# EAGLE schematic mother_card_rs_247pm (EAGLE 8.3.2)
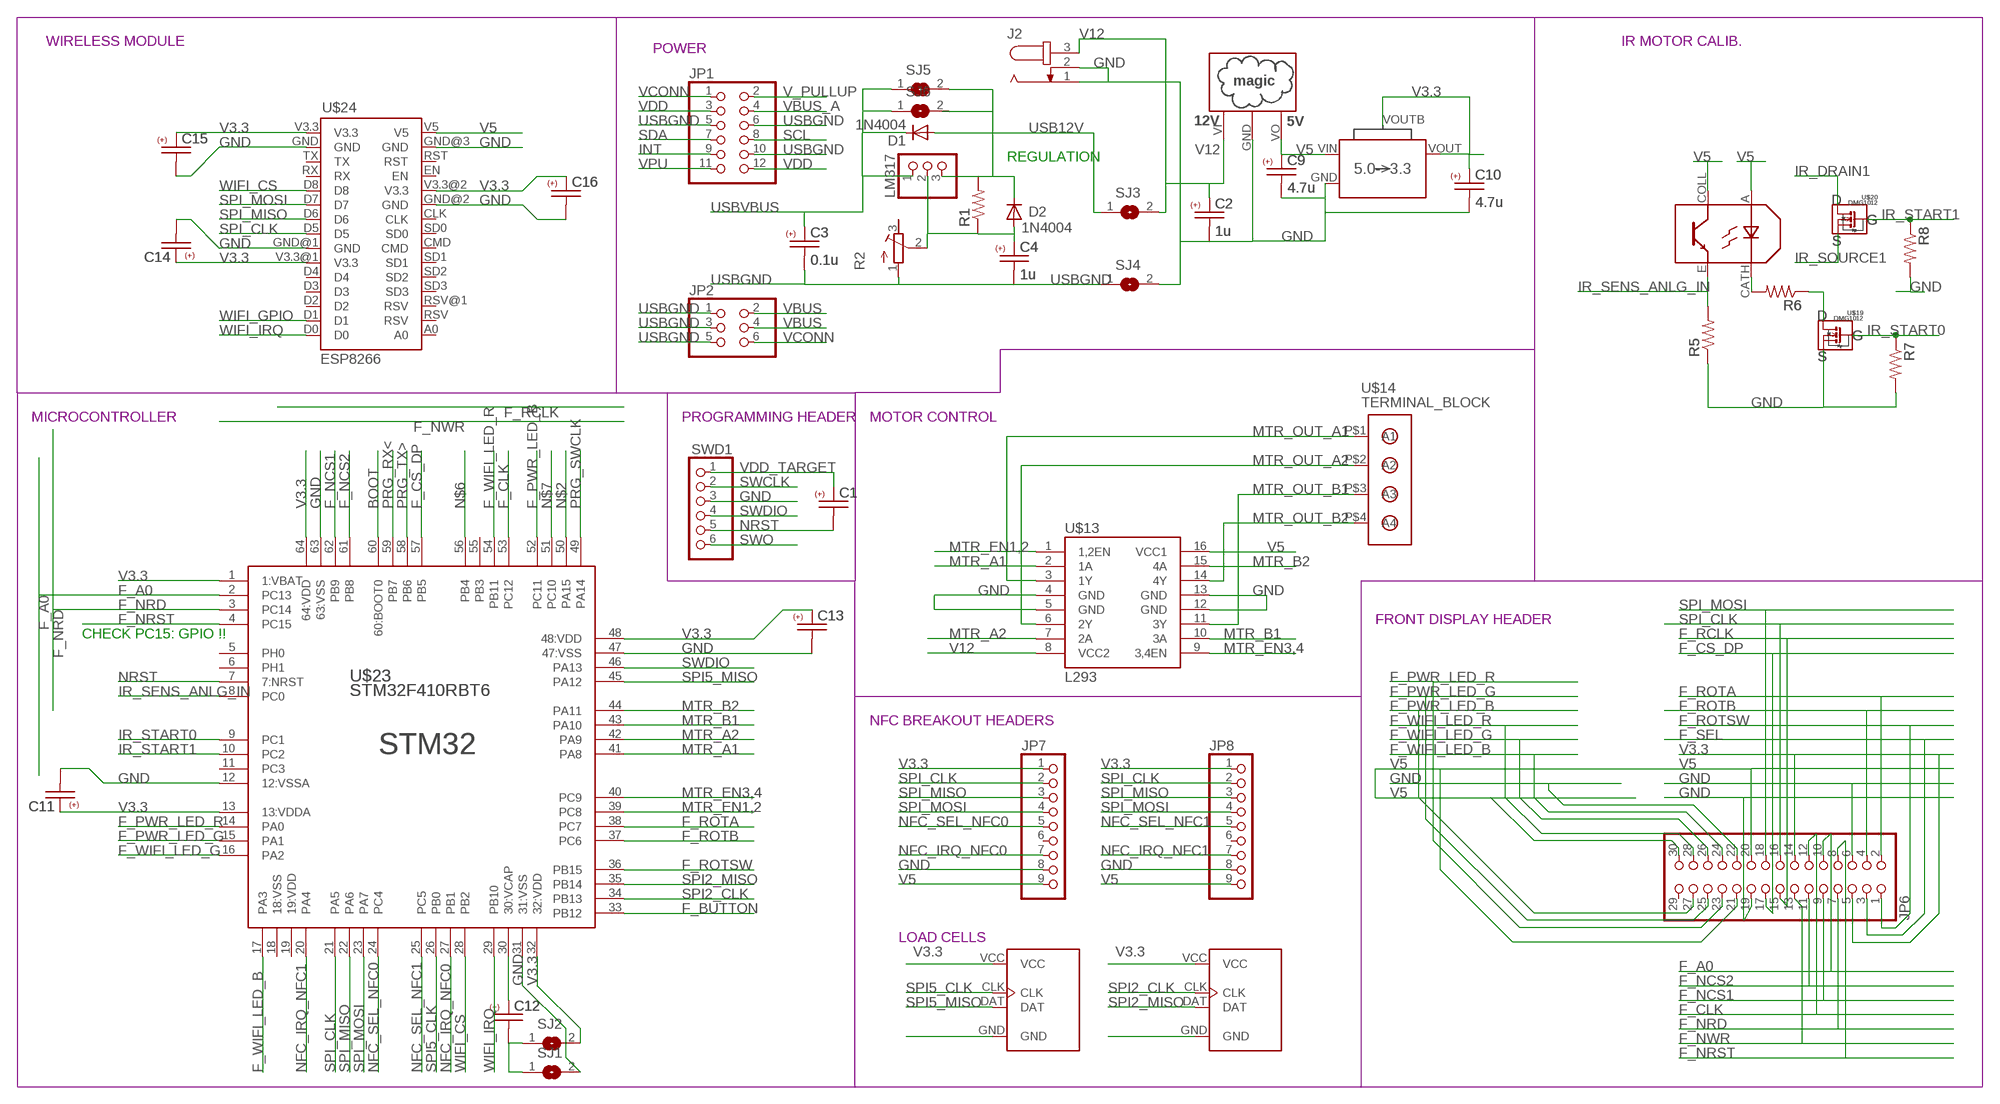
[diagram p0: schematic, sheet 1]

## Parts
C1  C-USC0805  [C0805]
C2  1u  C-USC0805  [C0805]
C3  0.1u  C-USC0805  [C0805]
C4  1u  C-USC0805  [C0805]
C9  4.7u  C-USC0805  [C0805]
C10  4.7u  C-USC0805  [C0805]
C11  C-USC0805  [C0805]
C12  C-USC0805  [C0805]
C13  C-USC0805  [C0805]
C14  C-USC0805  [C0805]
C15  C-USC0805  [C0805]
C16  C-USC0805  [C0805]
D1  1N4004  [DO41-10]
D2  1N4004  [DO41-10]
J2  JACK-PLUG0  [SPC4077]
JP1  PINHD-2X6  [2X06]
JP2  PINHD-2X3  [2X03]
JP6  PINHD-2X15/SOCK  [2X15/SOCK]
JP7  PINHD-1X9/90  [1X09/90]
JP8  PINHD-1X9/90  [1X09/90]
LM317  PINHD-1X3  [1X03]
R1  R-US_R0805  [R0805]
R2  R-TRIMM64W  [RTRIM64W]
R5  R-US_R0805  [R0805]
R6  R-US_R0805  [R0805]
R7  R-US_R0805  [R0805]
R8  R-US_R0805  [R0805]
SJ1  SJ  [SJ]
SJ2  SJ  [SJ]
SJ3  SJ  [SJ]
SJ4  SJ  [SJ]
SJ5  SJ  [SJ]
SJ6  SJ  [SJ]
SWD1  PINHD-1X6  [1X06]
U$13  L293  [DIL16]
U$14  TERMINAL_BLOCK  [1X4/BLOCK]
U$15  AP2114H  [AP2114H]
U$16  OKI-78SR-W36  [SIP3]
U$18  TCRT5000  [TCRT5000]
U$19  DMG1012  [SOT323]
U$20  DMG1012  [SOT323]
U$21  HX711  [HX711]
U$22  HX711  [HX711]
U$23  STM32F410RBT6  [QFP50P1200X1200X160-64N]
U$24  ESP8266  [ESP8266]

## Nets
BOOT: U$23.60(60:BOOT0)
F_A0: JP6.10 U$23.2(PC13)
F_BUTTON: U$23.33(PB12)
F_CLK: JP6.12 U$23.53(PC12)
F_CS_DP: JP6.17 U$23.57(PB5)
F_NCS1: JP6.9 U$23.62(PB9)
F_NCS2: JP6.11 U$23.61(PB8)
F_NRD: JP6.7 U$23.3(PC14)
F_NRST: JP6.8 U$23.4(PC15)
F_NWR: JP6.13
F_PWR_LED_B: JP6.27 U$23.52(PC11)
F_PWR_LED_G: JP6.25 U$23.15(PA1)
F_PWR_LED_R: JP6.23 U$23.14(PA0)
F_RCLK: JP6.15
F_ROTA: JP6.2 U$23.38(PC7)
F_ROTB: JP6.4 U$23.37(PC6)
F_ROTSW: JP6.1 U$23.36(PB15)
F_SEL: JP6.3
F_WIFI_LED_B: JP6.24 U$23.17(PA3)
F_WIFI_LED_G: JP6.26 U$23.16(PA2)
F_WIFI_LED_R: JP6.28 U$23.54(PB11)
GND: C2.2 C9.2 C10.2 C11.2 C13.2 C14.2 C15.2 C16.2 J2.1 J2.2 JP6.6 JP6.19 JP6.22 JP7.8 JP8.8 R5.1 R7.2 R8.2 SJ1.2 SJ4.2 SWD1.3 U$13.4(GND) U$13.5(GND) U$13.12(GND) U$13.13(GND) U$15.GND U$16.GND U$19.S U$21.GND U$22.GND U$23.12(12:VSSA) U$23.31(31:VSS) U$23.47(47:VSS) U$23.63(63:VSS) U$24.GND U$24.GND@1(GND) U$24.GND@2(GND) U$24.GND@3(GND)
INT: JP1.9
IR_DRAIN1: U$20.D
IR_SENS_ANLG_IN: R5.2 U$18.E U$23.8(PC0)
IR_SOURCE1: U$20.S
IR_START0: R7.1 U$19.G U$23.9(PC1)
IR_START1: R8.1 U$20.G U$23.10(PC2)
MTR_A1: U$13.2(1A) U$23.41(PA8)
MTR_A2: U$13.7(2A) U$23.42(PA9)
MTR_B1: U$13.10(3A) U$23.43(PA10)
MTR_B2: U$13.15(4A) U$23.44(PA11)
MTR_EN1,2: U$13.1(1,2EN) U$23.39(PC8)
MTR_EN3,4: U$13.9(3,4EN) U$23.40(PC9)
MTR_OUT_A1: U$13.3(1Y) U$14.P$1(A1)
MTR_OUT_A2: U$13.6(2Y) U$14.P$2(A2)
MTR_OUT_B1: U$13.11(3Y) U$14.P$3(A3)
MTR_OUT_B2: U$13.14(4Y) U$14.P$4(A4)
N$1: C12.1 U$23.30(30:VCAP)
N$2: U$23.50(PA15)
N$3: C12.2 SJ1.1 SJ2.1
N$4: C4.1 D2.A LM317.2 R1.1 R2.2(S)
N$5: R6.2 U$18.CATH
N$6: U$23.56(PB4)
N$7: U$23.51(PC10)
N$10: R6.1 U$19.D
NFC_IRQ_NFC0: JP7.7 U$23.27(PB1)
NFC_IRQ_NFC1: JP8.7 U$23.20(PA4)
NFC_SEL_NFC0: JP7.5 U$23.24(PC4)
NFC_SEL_NFC1: JP8.5 U$23.25(PC5)
NRST: C1.2 SWD1.5 U$23.7(7:NRST)
PRG_RX<: U$23.59(PB7)
PRG_SWCLK: U$23.49(PA14)
PRG_TX>: U$23.58(PB6)
SCL: JP1.8
SDA: JP1.7
SPI2_CLK: U$22.CLK U$23.34(PB13)
SPI2_MISO: U$22.DAT U$23.35(PB14)
SPI5_CLK: U$21.CLK U$23.26(PB0)
SPI5_MISO: U$21.DAT U$23.45(PA12)
SPI_CLK: JP6.16 JP7.2 JP8.2 U$23.21(PA5) U$24.D5
SPI_MISO: JP7.3 JP8.3 U$23.22(PA6) U$24.D6
SPI_MOSI: JP6.18 JP7.4 JP8.4 U$23.23(PA7) U$24.D7
SWCLK: SWD1.2
SWDIO: SWD1.4 U$23.46(PA13)
SWO: SWD1.6
USB12V: D1.A D2.C LM317.3 R1.2 SJ3.1 SJ5.2
USBGND: C3.2 C4.2 JP1.5 JP1.6 JP1.10 JP2.1 JP2.3 JP2.5 R2.1(A) SJ4.1
USBVBUS: C3.1 D1.C LM317.1 SJ5.1 SJ6.1
V3.3: C10.1 C11.1 C13.1 C14.1 C15.1 C16.1 JP6.5 JP6.14 JP7.1 JP8.1 SJ2.2 U$15.VOUT(VO) U$15.VOUTB(BODY) U$21.VCC U$22.VCC U$23.1(1:VBAT) U$23.13(13:VDDA) U$23.32(32:VDD) U$23.48(48:VDD) U$23.64(64:VDD) U$24.V3.3 U$24.V3.3@1(V3.3) U$24.V3.3@2(V3.3)
V5: C9.1 JP6.20 JP6.21 JP6.30 JP7.9 JP8.9 U$13.16(VCC1) U$15.VIN(VI) U$16.VO U$18.A U$18.COLL U$24.V5
V12: C2.1 J2.3 SJ3.2 U$13.8(VCC2) U$16.VI
V_PULLUP: JP1.2
VBUS: JP2.2 JP2.4
VBUS_A: JP1.4
VCONN: JP1.1 JP2.6
VDD: JP1.3 JP1.12
VDD_TARGET: C1.1 SWD1.1
VPU: JP1.11
WIFI_CS: U$23.28(PB2) U$24.D8
WIFI_GPIO: U$24.D1
WIFI_IRQ: U$23.29(PB10) U$24.D0
Unconnected: JP6.29 JP7.6 JP8.6 R2.3(E) SJ6.2 U$23.5(PH0) U$23.6(PH1) U$23.11(PC3) U$23.18(18:VSS) U$23.19(19:VDD) U$23.55(PB3) U$24.A0 U$24.CLK U$24.CMD U$24.D2 U$24.D3 U$24.D4 U$24.EN U$24.RST U$24.RSV U$24.RSV@1(RSV) U$24.RX U$24.SD0 U$24.SD1 U$24.SD2 U$24.SD3 U$24.TX

## Notes on the sheet
- WIRELESS MODULE | IR MOTOR CALIB.
- POWER
- REGULATION
- MICROCONTROLLER | PROGRAMMING HEADER | MOTOR CONTROL
- FRONT DISPLAY HEADER
- CHECK PC15: GPIO !!
- NFC BREAKOUT HEADERS
- LOAD CELLS

## Library data of the parts
C1-C4 C9-C16 = seniorDesign:C-US: CAPACITOR, American symbol
D1 D2 = diode:1N4004: DIODE general purpose rectifier, 1 A
J2 = con-jack:JACK-PLUG: DC POWER JACK Power Jack, DC, Right Angle, Through Hole, Rated 5A at 16VDC, PC Terminals Distributor: Farnell (www.Farnell.de) Drawing: 84N1161.pdf / 84N1162.pdf Manufacturer: SPC Technology (www.spctechnology.com) Type: SPC4077 / SPC 4078; OC_FARNELL: unknown; OC_NEWARK: unknown
JP1 = pinhead:PINHD-2X6: PIN HEADER
JP2 = pinhead:PINHD-2X3: PIN HEADER
JP6 = csomers:PINHD-2X15: PIN HEADER, socket for parallel cable, IDC connector, On Shore Technology Inc.
JP7 JP8 = pinhead:PINHD-1X9: PIN HEADER
LM317 = pinhead:PINHD-1X3: PIN HEADER
R1 R5-R8 = seniorDesign:R-US_: RESISTOR, American symbol
R2 = rcl:R-TRIMM: Trimm resistor
SJ1-SJ6 = jumper:SJ: SMD solder JUMPER
SWD1 = pinhead:PINHD-1X6: PIN HEADER
U$13 = seniorDesign:L293: L293 Stepper Motor Driver
U$14 = seniorDesign:TERMINAL_BLOCK: Terminal Block for stepper motor connections
U$15 = seniorDesign:AP2114: AP2114H-3.3TRG1DICT-ND 5V LDO, main 5V line, motherboard https://www.diodes.com/assets/Datasheets/AP2114.pdf
U$16 = seniorDesign:OKI-78SR-W36
U$18 = seniorDesign:TCRT5000: Vishay Semiconductor Opto Division TCRT5000 mother board cover repositioning http://www.vishay.com/docs/83760/tcrt5000.pdf
U$19 U$20 = seniorDesign:DMG1012: DMG1012UW-7DICT-ND https://www.diodes.com/assets/Datasheets/ds31859.pdf Vt ~= 1.25V, IDS ~= 0.900 A, [VGS = (3.3 - 0.7)V, VDS = 0V]
U$21 U$22 = seniorDesign:HX711: old green circuit board rendition of HX711 load amplifier
U$23 = seniorDesign:STM32F410RBT6: STMicroelectronics STM32F410RBT6 main microcontroller, motherboard http://www.st.com/.../content/translations/en.DM00214043.pdf <http://www.st.com/content/ccc/resource/technical/document/datasheet/6e/f3/b0/1b/05/eb/49/fe/DM00214043.pdf/files/DM00214043.pdf/jcr:content/translations/en.DM00214043.pdf>
U$24 = seniorDesign:ESP8266: ESP8266 Wifi Module Breakout